# Altium schematic sheet 01 - MCU.SchDoc
size A4; DocumentNumber: 3; SheetNumber: 3; SheetTotal: 4
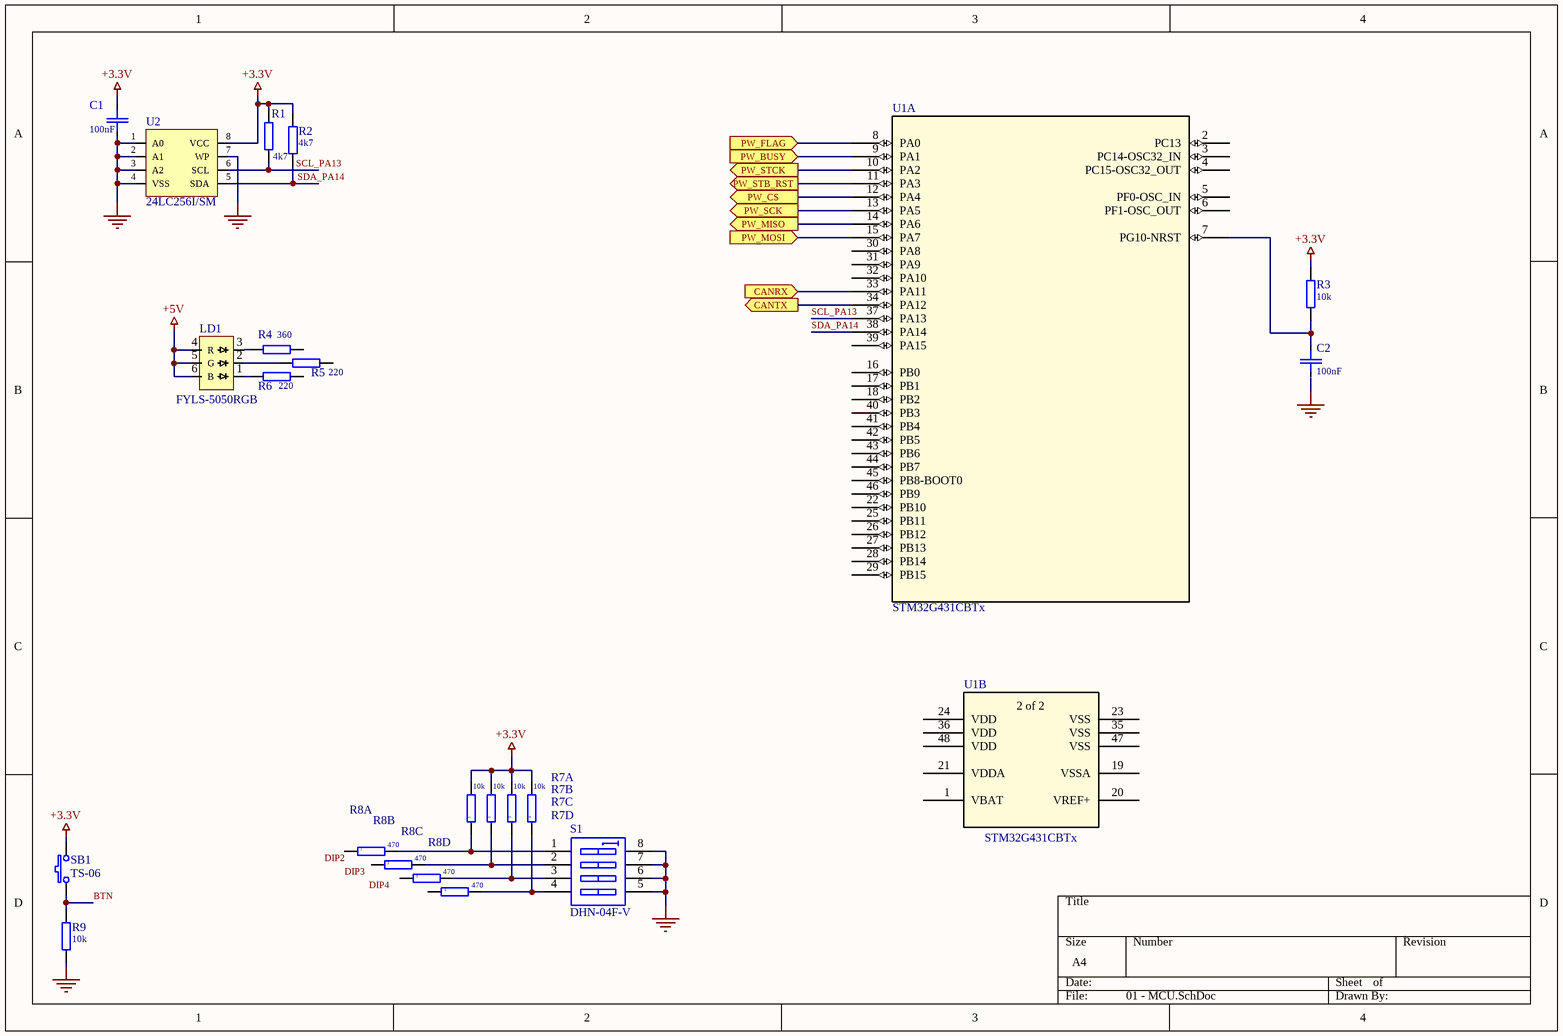
[diagram p0: 01 - MCU.SchDoc]

## Parts
C1  100nF  [CAP: 0805]
C2  100nF  [CAP: 0805]
LD1  FYLS-5050RGB  [FYLS-5050RGB]
R1  4k7  [RES: 0603]
R2  4k7  [RES: 0603]
R3  10k  [RES: 0603]
R4  360  [RES: 0603]
R5  220  [RES: 0603]
R6  220  [RES: 0603]
R7  10k  [RM4x0603]  (parts A,B,C,D of 4)
R8  470  [RM4x0603]  (parts A,B,C,D of 4)
R9  10k  [RES: 0603]
S1  DHN-04F-V  [SOIC-8-DIP_W]
SB1  TS-06  [TS-06]
U1  STM32G431CBTx  [LQFP48-7x7mm]  (parts A,B of 2)
U2  24LC256I/SM  [SOP-8N (SOIJ)]

## Ports
CANRX (in), CANTX (out), PW_BUSY (in), PW_CS (out), PW_FLAG (in), PW_MISO (out), PW_MOSI (in), PW_SCK (out), PW_STB_RST (out), PW_STCK (out)

## Nets
+3.3V: C1.1 R1.2 R2.2 R3.1 R7.5 R7.6 R7.7 R7.8 SB1.2 U2.8(VCC)
+5V: LD1.4(R) LD1.5(G) LD1.6(B)
GND: C1.2 C2.2 R9.2 S1.5(B4) S1.6(B3) S1.7(B2) S1.8(B1) U2.1(A0) U2.2(A1) U2.3(A2) U2.4(VSS) U2.7(WP)
BTN: R9.1 SB1.1
CANRX: U1.33(PA11) ; port CANRX
CANTX: U1.34(PA12) ; port CANTX
PW_BUSY: U1.9(PA1) ; port PW_BUSY
PW_CS: U1.12(PA4) ; port PW_CS
PW_FLAG: U1.8(PA0) ; port PW_FLAG
PW_MISO: U1.14(PA6) ; port PW_MISO
PW_MOSI: U1.15(PA7) ; port PW_MOSI
PW_SCK: U1.13(PA5) ; port PW_SCK
PW_STB_RST: U1.11(PA3) ; port PW_STB_RST
PW_STCK: U1.10(PA2) ; port PW_STCK
SCL_PA13: R1.1 U1.37(PA13) U2.6(SCL)
SDA_PA14: R2.1 U1.38(PA14) U2.5(SDA)
NetC2_1: C2.1 R3.2 U1.7(PG10-NRST)
NetLD1_1: LD1.1 R6.2
NetLD1_2: LD1.2 R5.2
NetLD1_3: LD1.3 R4.1
NetR7_1: R7.1 R8.8 S1.1(A1)
NetR7_2: R7.2 R8.7 S1.2(A2)
NetR7_3: R7.3 R8.6 S1.3(A3)
NetR7_4: R7.4 R8.5 S1.4(A4)

Not connected (* = marked no-connect by the designer): R4 2; R5 1; R6 1; R8 1 2 3 4; U1 1(VBAT) 2(PC13) 3(PC14-OSC32_IN) 4(PC15-OSC32_OUT) 5(PF0-OSC_IN) 6(PF1-OSC_OUT) 16(PB0) 17(PB1) 18(PB2) 19(VSSA) 20(VREF+) 21(VDDA) 22(PB10) 23(VSS) 24(VDD) 25(PB11) 26(PB12) 27(PB13) 28(PB14) 29(PB15) 30(PA8) 31(PA9) 32(PA10) 35(VSS) 36(VDD) 39(PA15) 40(PB3) 41(PB4) 42(PB5) 43(PB6) 44(PB7) 45(PB8-BOOT0) 46(PB9) 47(VSS) 48(VDD)

## Notes on the sheet
- Labels drawn without touching a wire or pin: DIP2, DIP3, DIP4
- (in symbol STM32G431CBTx, part B) 2 of 2

## Library data of the parts
C1 C2 = C-0805: SMD-0805; Price: 0.014; Value: 100nF
R1-R6 R9 = R-0603: SMD 0603 0.0625W 5% 50V; Price: 0.017
  R1 R2: Value: 4k7
  R3 R9: Value: 10k
  R4: Value: 360
  R5 R6: Value: 220
R7 R8 = 4RM-0603: SMD 4RM-0603 1\16W 5%; Price: 0.07; ComponentLink1Description: New link
  R7: Value: 10k; ComponentLink1URL: https://www.electronshik.ru/item/BOURNS/CAT16-103J4LF
  R8: Value: 470; ComponentLink1URL: https://www.electronshik.ru/item/BOURNS/CAT16-471J4LF
S1 = SW DIP-4: DIP Switch, 4 Position, SPST; Published: 24-Mar-1999; LatestRevisionDate: 29-May-2009; LatestRevisionNote: IPC-7351 Footprint Added.; PackageVersion: Dec-2002; PackageReference: SO8; Publisher: Altium Limited; PackageDescription: 8-Pin Small Outline Integrated Circuit 1.27 mm Pitch; Code_JEDEC: MS-012-AA; Code_IPC: SOIC127P600-8; ComponentLink1Description: New link; ComponentLink1URL: https://www.electronshik.ru/item/DIP/DHN-04F-V
SB1 = Buton TS-06: Price: 0.15
U1 = STM32G431CBTx: Mainstream Arm Cortex-M4 core with DSP and FPU, 170MHz with 128Kbytes of Flash memory, Math Accelerator, Medium Analog level integration; Manufacturer_Part_Number: stm32g4_lqfp48_t1; Built_By: EMA_Jessica; Vendor: STMicroelectronics; Copyright: Copyright (C) 2016 Accelerated Designs. All rights reserved; RefDes: RefDes; Type: DEV; Value: Value
LD1 = FYLS-5050RGB: ComponentLink1Description: New link; ComponentLink1URL: https://www.chipdip.ru/catalog/smd-leds?gq=FYLS-5050RGB
U2 = 24LC256I/SM: ComponentLink1Description: New link; ComponentLink1URL: https://www.chipdip.ru/product/24lc256-i-sm